# EAGLE design ultrasound (EAGLE 8.5.2)
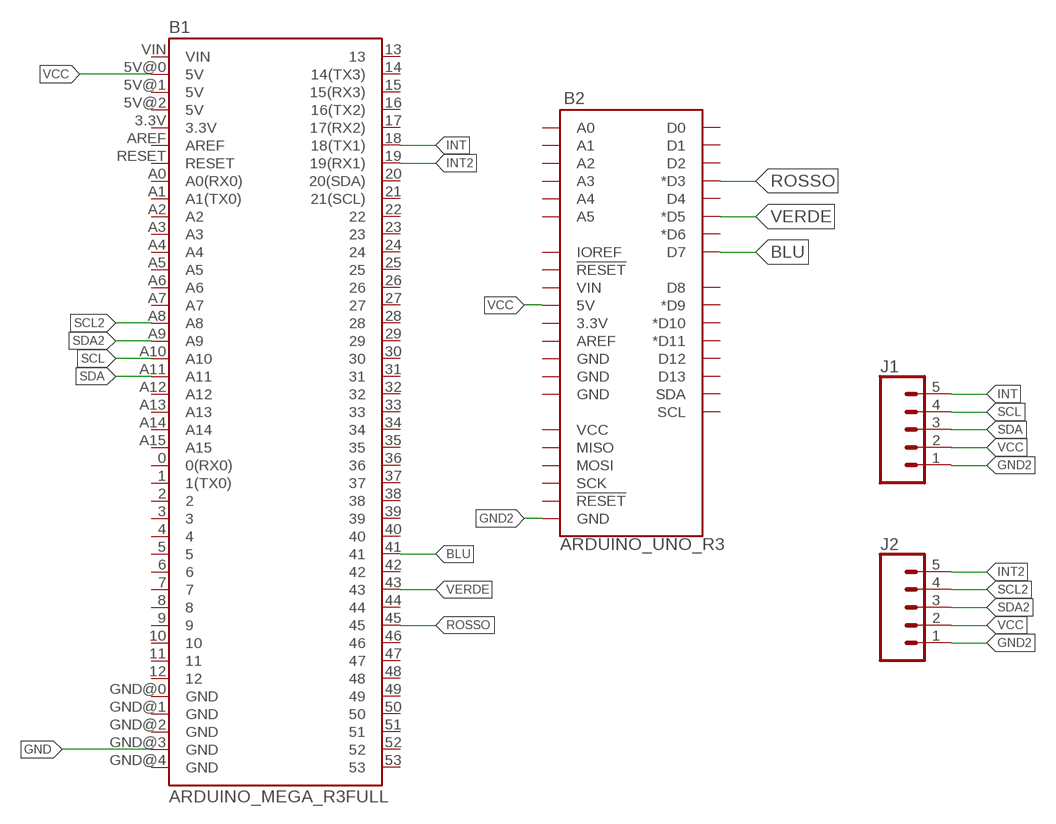
[diagram p0: schematic, sheet 1]

## Parts
B1  ARDUINO_MEGA_R3FULL  [ARDUINO_MEGA]
B2  ARDUINO_UNO_R3  [ARDUINO_R3]
J1  CONN_05  [1X05]
J2  CONN_05  [1X05]

## Nets
BLU: B1.41 B2.D7
GND: B1.GND@3(GND)
GND2: B2.GND@1(GND) J1.1 J2.1
INT: B1.18(18(TX1)) J1.5
INT2: B1.19(19(RX1)) J2.5
ROSSO: B1.45 B2.D3(*D3)
SCL: B1.A10 J1.4
SCL2: B1.A8 J2.4
SDA: B1.A11 J1.3
SDA2: B1.A9 J2.3
VCC: B1.5V@0(5V) B2.5V J1.2 J2.2
VERDE: B1.43 B2.D5(*D5)
Unconnected: B1.0(0(RX0)) B1.1(1(TX0)) B1.2 B1.3 B1.3.3V B1.4 B1.5 B1.5V@1(5V) B1.5V@2(5V) B1.6 B1.7 B1.8 B1.9 B1.10 B1.11 B1.12 B1.13 B1.14(14(TX3)) B1.15(15(RX3)) B1.16(16(TX2)) B1.17(17(RX2)) B1.20(20(SDA)) B1.21(21(SCL)) B1.22 B1.23 B1.24 B1.25 B1.26 B1.27 B1.28 B1.29 B1.30 B1.31 B1.32 B1.33 B1.34 B1.35 B1.36 B1.37 B1.38 B1.39 B1.40 B1.42 B1.44 B1.46 B1.47 B1.48 B1.49 B1.50 B1.51 B1.52 B1.53 B1.A0(A0(RX0)) B1.A1(A1(TX0)) B1.A2 B1.A3 B1.A4 B1.A5 B1.A6 B1.A7 B1.A12 B1.A13 B1.A14 B1.A15 B1.AREF B1.GND@0(GND) B1.GND@1(GND) B1.GND@2(GND) B1.GND@4(GND) B1.RESET B1.VIN B2.3.3V B2.A0 B2.A1 B2.A2 B2.A3 B2.A4 B2.A5 B2.AREF B2.D0 B2.D1 B2.D2 B2.D4 B2.D6(*D6) B2.D8 B2.D9(*D9) B2.D10(*D10) B2.D11(*D11) B2.D12 B2.D13 B2.GND@2(GND) B2.GND@3(GND) B2.GND@4(GND) B2.IOREF B2.MISO B2.MOSI B2.RESET@1(!RESET!) B2.RESET@2(!RESET!) B2.SCK B2.SCL B2.SDA B2.VCC B2.VIN

## Library data of the parts
B1 = SparkFun-Boards:ARDUINO_MEGA_R3: Arduino Mega R3 ATmega2560 R3 compatible footprint. SparkFun Products: Arduino Mega 2560 R3 <https://www.sparkfun.com/products/11061>
B2 = SparkFun-Boards:ARDUINO_UNO_R3: Arduino R3 Footprint with SPI header Arduino Uno R3 Compatible Footprint. Matches PCB size of the original board. SparkFun Products: SAMD21 Dev Breakout <https://www.sparkfun.com/products/13672> RedBoard <https://www.sparkfun.com/products/12757> R3 Stackable Headers <https://www.sparkfun.com/products/11417>
J1 J2 = SparkFun-Connectors:CONN_05: Multi connection point. Often used as Generic Header-pin footprint for 0.1 inch spaced/style header connections On any of the 0.1 inch spaced packages, you can populate with these: Break Away Headers - Straight <https://www.sparkfun.com/products/116> (PRT-00116) Break Away Male Headers - Right Angle <https://www.sparkfun.com/products/553> (PRT-00553) Female Headers <https://www.sparkfun.com/products/115> (PRT-00115) Break Away Headers - Machine Pin <https://www.sparkfun.com/products/117> (PRT-00117) Break Away Female Headers - Swiss Machine Pin <https://www.sparkfun.com/products/743> (PRT-00743) For SCREWTERMINALS and SPRING TERMINALS visit here: Screw Terimnals on SparkFun.com <https://www.sparkfun.com/search/results?term=Screw+Terminals> (5mm/3.5mm/2.54mm spacing) This device is also useful as a general connection point to wire up your design to another part of your project. Our various solder wires solder well into these plated through hole pads. Hook-Up Wire - Assortment (Stranded, 22 AWG) <https://www.sparkfun.com/products/11375> (PRT-11375) Hook-Up Wire - Assortment (Solid Core, 22 AWG) <https://www.sparkfun.com/products/11367> (PRT-11367) View the entire wire category on our website here <https://www.sparkfun.com/categories/141> Special notes: Molex polarized connector foot print use with SKU : PRT-08231 with associated crimp pins and housings. 1MM SMD Version SKU: PRT-10208

## Board
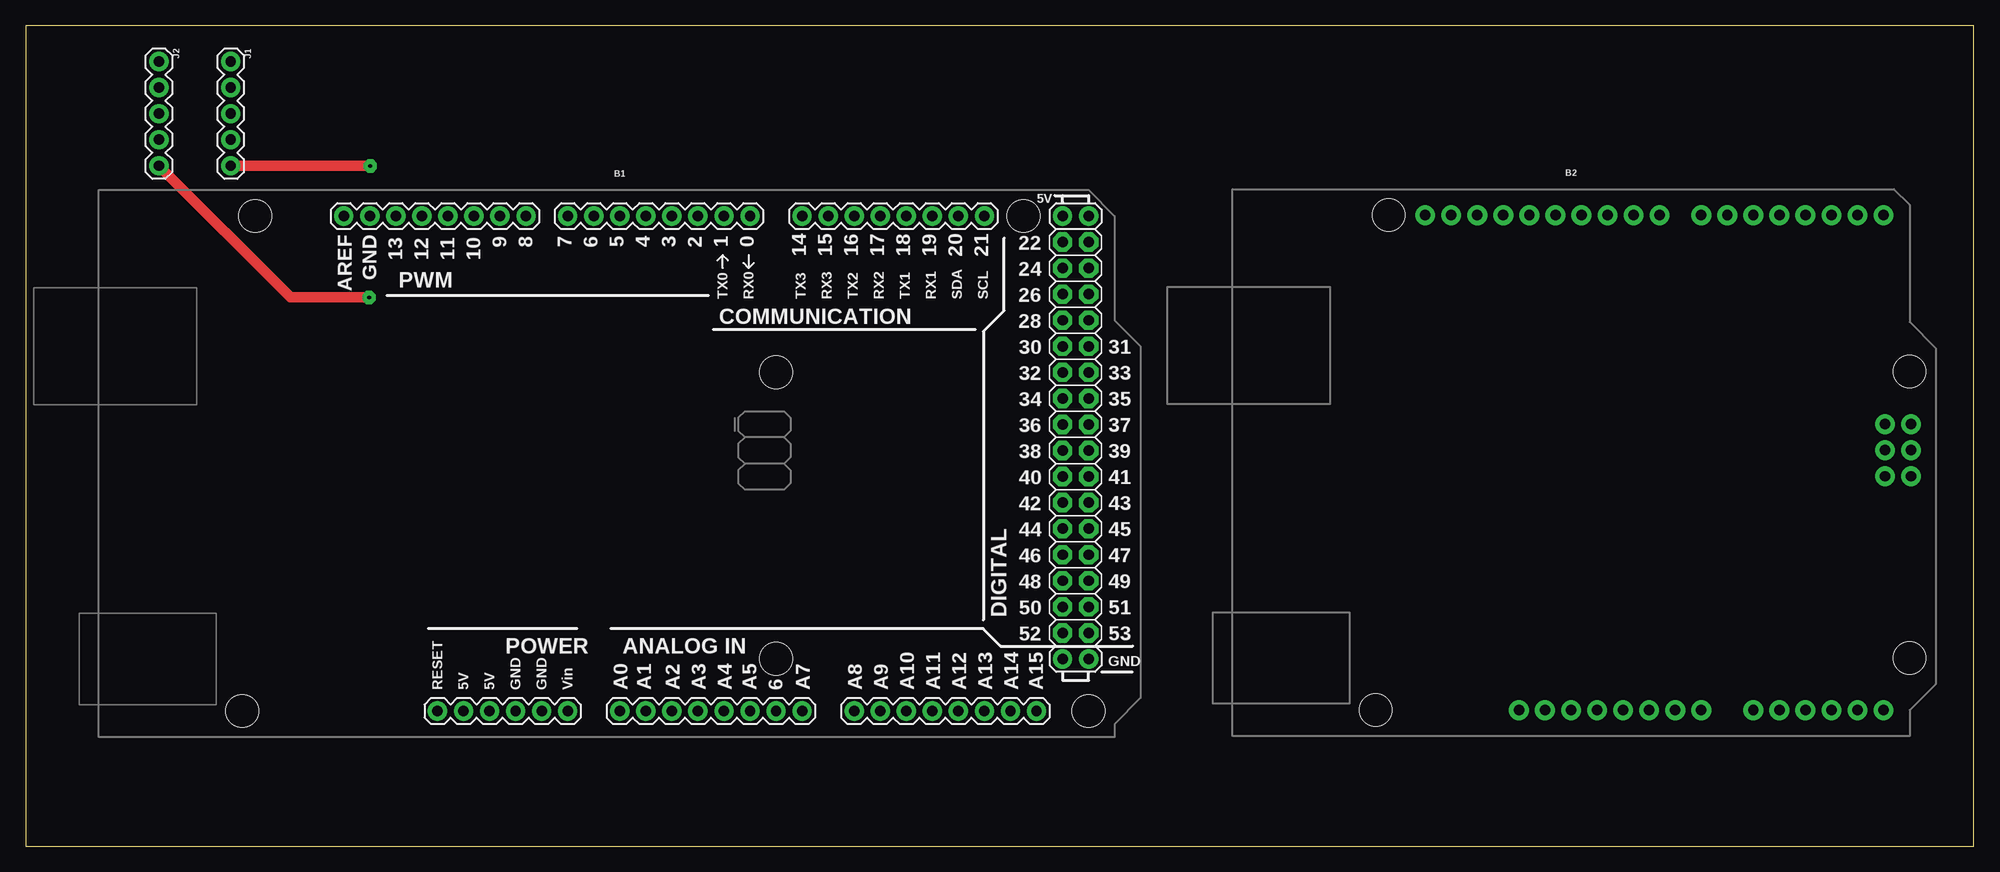
[diagram p1: board, top side]
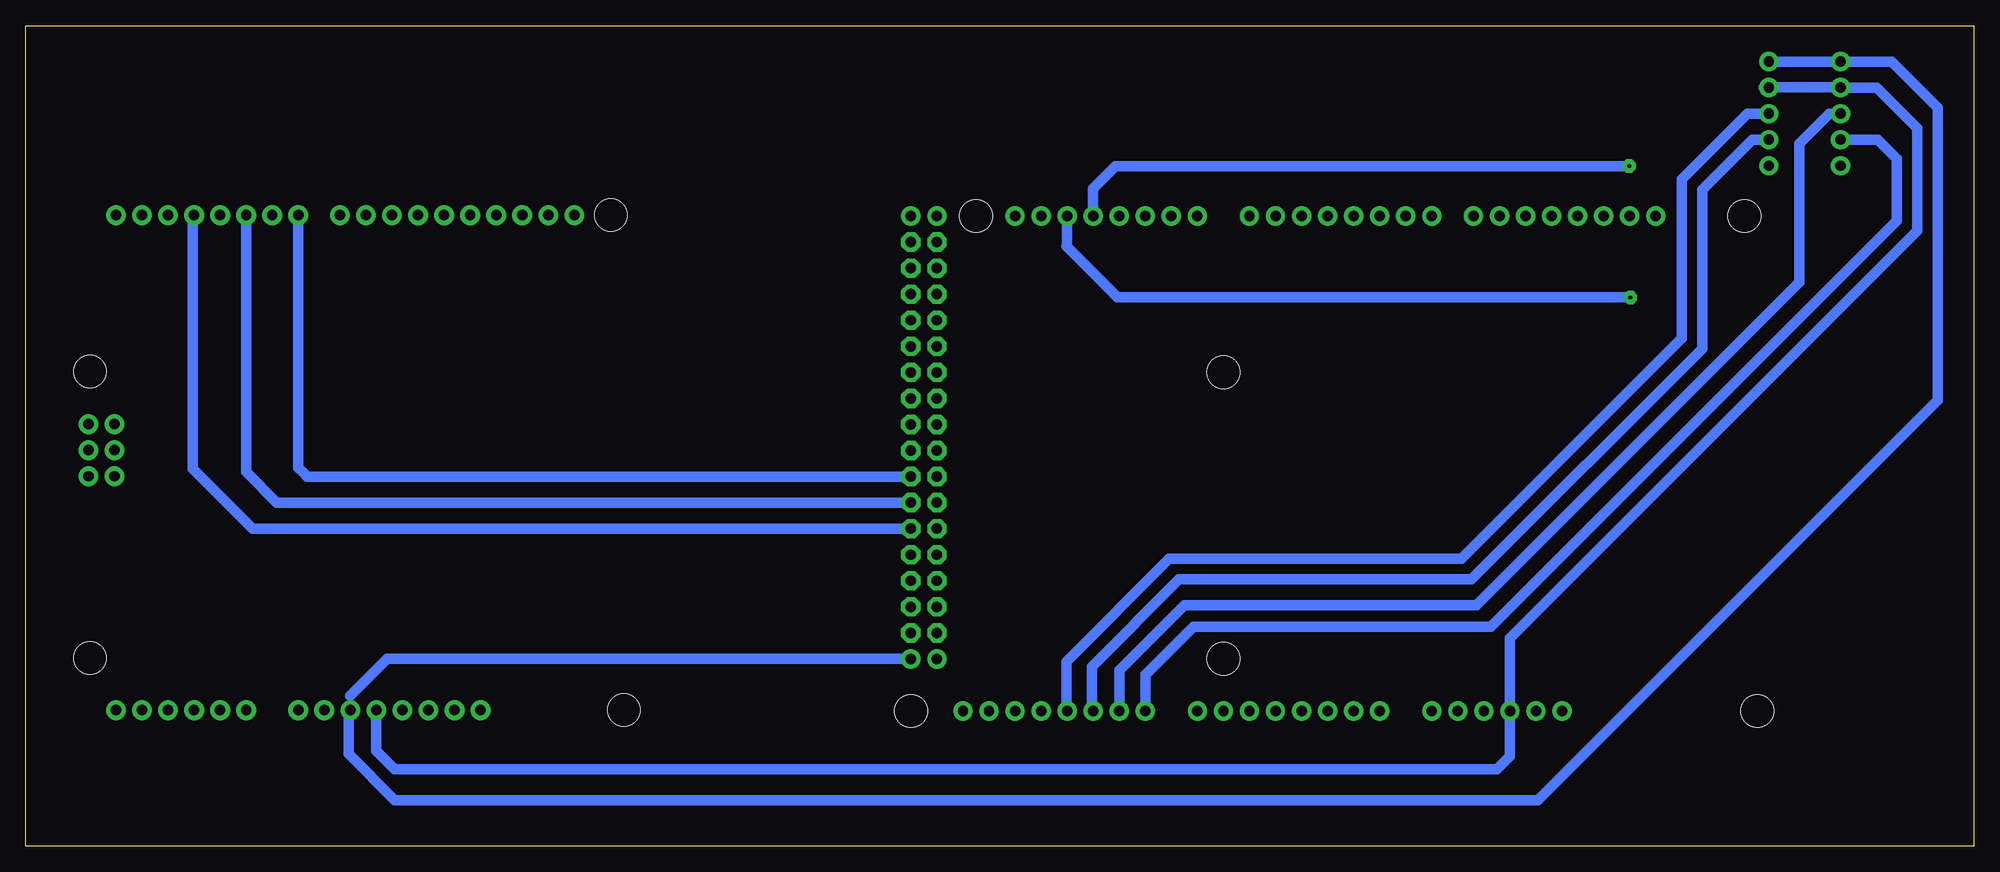
[diagram p2: board, bottom side, seen from below]

Size 190 x 80 mm. Coordinates in mm from the lower left corner, seen from the top.
Outline: 0,80 0,0 190,0 190,80 0,80
Copper layers (1*16): Top 0.035mm / dielectric 1.5mm / Bottom 0.035mm
Design rules "default": minimum track width 6mil, minimum drill 0.35mm, track to track 6mil, track to pad 6mil, pad to pad 6mil, via to via 6mil, smd to smd 6mil, copper to edge 40mil, drill to drill 6mil, minimum pad ring 10mil, minimum via ring 8mil, stop-mask expansion 4mil, vias tented up to drill 0mil, thermal gap 10mil

### Footprints (pad centres in the part's own frame; a part is rotated, then mirrored left to right if it is on the bottom)
ARDUINO_MEGA = drill 1.016 pad 1.88: 0 13.97,24.13; 1 11.43,24.13; 2 8.89,24.13; 3 6.35,24.13; 3.3V -13.97,-24.13; 4 3.81,24.13; 5 1.27,24.13; 5V@0 -11.43,-24.13; 5V@1 44.45,24.13; 5V@2 46.99,24.13; 6 -1.27,24.13; 7 -3.81,24.13; 8 -7.874,24.13; 9 -10.414,24.13; 10 -12.954,24.13; 11 -15.494,24.13; 12 -18.034,24.13; 13 -20.574,24.13; 14 19.05,24.13; 15 21.59,24.13; 16 24.13,24.13; 17 26.67,24.13; 18 29.21,24.13; 19 31.75,24.13; 20 34.29,24.13; 21 36.83,24.13; A0 1.27,-24.13; A1 3.81,-24.13; A2 6.35,-24.13; A3 8.89,-24.13; A4 11.43,-24.13; A5 13.97,-24.13; A6 16.51,-24.13; A7 19.05,-24.13; A8 24.13,-24.13; A9 26.67,-24.13; A10 29.21,-24.13; A11 31.75,-24.13; A12 34.29,-24.13; A13 36.83,-24.13; A14 39.37,-24.13; A15 41.91,-24.13; AREF -25.654,24.13; GND@0 -8.89,-24.13; GND@1 -6.35,-24.13; GND@2 44.45,-19.05; GND@3 46.99,-19.05; GND@4 -23.114,24.13; RESET -16.51,-24.13; VIN -3.81,-24.13 | drill 1.016 pad 1.88 octagon: 22 44.45,21.59; 23 46.99,21.59; 24 44.45,19.05; 25 46.99,19.05; 26 44.45,16.51; 27 46.99,16.51; 28 44.45,13.97; 29 46.99,13.97; 30 44.45,11.43; 31 46.99,11.43; 32 44.45,8.89; 33 46.99,8.89; 34 44.45,6.35; 35 46.99,6.35; 36 44.45,3.81; 37 46.99,3.81; 38 44.45,1.27; 39 46.99,1.27; 40 44.45,-1.27; 41 46.99,-1.27; 42 44.45,-3.81; 43 46.99,-3.81; 44 44.45,-6.35; 45 46.99,-6.35; 46 44.45,-8.89; 47 46.99,-8.89; 48 44.45,-11.43; 49 46.99,-11.43; 50 44.45,-13.97; 51 46.99,-13.97; 52 44.45,-16.51; 53 46.99,-16.51 | hole 3.2: -34.29,24.13; -35.56,-24.13; 16.51,8.89; 16.51,-19.05; 40.64,24.13; 46.99,-24.13
ARDUINO_R3 = drill 1.016 pad 1.93: 3.3V 2.54,-24.13; 5V 5.08,-24.13; A0 17.78,-24.13; A1 20.32,-24.13; A2 22.86,-24.13; A3 25.4,-24.13; A4 27.94,-24.13; A5 30.48,-24.13; AREF -9.144,24.13; D0 30.48,24.13; D1 27.94,24.13; D2 25.4,24.13; D3 22.86,24.13; D4 20.32,24.13; D5 17.78,24.13; D6 15.24,24.13; D7 12.7,24.13; D8 8.636,24.13; D9 6.096,24.13; D10 3.556,24.13; D11 1.016,24.13; D12 -1.524,24.13; D13 -4.064,24.13; GND@1 7.62,-24.13; GND@2 10.16,-24.13; GND@3 -6.604,24.13; GND@4 33.16,-1.32; IOREF -2.54,-24.13; MISO 30.62,3.76; MOSI 33.16,1.22; NC -5.08,-24.13; RESET@1 0,-24.13; RESET@2 30.62,-1.32; SCK 30.62,1.22; SCL -14.224,24.13; SDA -11.684,24.13; VCC 33.16,3.76; VIN 12.7,-24.13 | hole 3.175: -17.78,24.13; 33.02,8.89; 33.02,-19.05; -19.05,-24.13
1X05 = drill 1.016 pad 1.88: 1 0,0; 2 2.54,0; 3 5.08,0; 4 7.62,0; 5 10.16,0

### Placement (x,y rotation side)
B1  56.68,37.31 0 top
B2  150.72,37.39 0 top
J1  20,76.5 270 top
J2  13,76.5 270 top

### Tracks (layer width: path | path; a pad name or v marks a point on that pad's centre or on a via)
BLU
  Bottom 1.016: B2.D7 163.41,36.91 163,36.5 162.54,36.04 B1.41
GND
  Bottom 1.016: B1.GND@3 154.74,18.26 158.34,14.66
GND2
  Bottom 1.016: J1.1 J2.1 8,76.5 3.5,72 3.5,43.5 42.5,4.5 57,4.5 154,4.5 158.5,9 158.5,13.1 B2.GND@1
INT  (via drill 0.35 pad 1.3)
  Top 1.016: J1.5 33.56,66.34 v33.6,66.3
  Bottom 1.016: v33.6,66.3 83.7,66.3 85.9,64.1 B1.18
INT2  (via drill 0.35 pad 1.3)
  Top 1.016: J2.5 25.84,53.5 v33.5,53.5
  Bottom 1.016: v33.5,53.5 83.5,53.5 88.5,58.5 88.43,58.57 B1.19
N$1
  Bottom 0.001: 0,80 0,0 190,0 190,80 0,80
ROSSO
  Bottom 1.016: B1.45 167.86,30.96 173.7,36.8 173.7,61.4 B2.D3
SCL
  Bottom 1.016: J1.4 21.62,68.88 26.5,64 26.5,48.5 49,26 77.5,26 86,17.5 86,13.29 B1.A10
SCL2
  Bottom 1.016: B1.A8 80.81,16.69 76.12,21.38 47.12,21.38 7.5,61 7.5,67 9.38,68.88 J2.4
SDA
  Bottom 1.016: J1.3 22.08,71.42 28.5,65 28.5,49.5 50,28 78.5,28 88.5,18 88.5,13.25 B1.A11
SDA2
  Bottom 1.016: B1.A9 83.35,17.15 77,23.5 48.5,23.5 17,55 17,68.5 14.08,71.42 J2.3
VCC
  Bottom 1.016: B2.5V 155.79,9.29 154,7.5 46.5,7.5 45.25,8.75 B1.5V@0 45.25,20.25 5.5,60 5.5,70 9.46,73.96 J2.2 13.04,74 20.04,74 | 20.5,74 20.04,74 | 20.04,74 J1.2
VERDE
  Bottom 1.016: B1.43 165.5,33.5 168.5,36.5 B2.D5